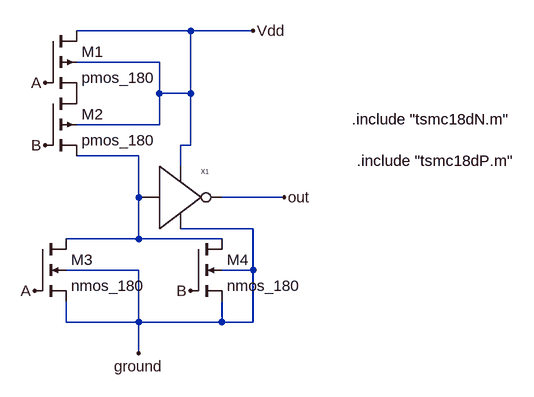
[diagram p0: schematic CMOS_OR.asc]
CMOS_OR.asc, the LTspice schematic file:
Version 4.1
SHEET 1 1396 704
WIRE 448 80 272 80
WIRE 544 80 448 80
WIRE 400 128 272 128
WIRE 400 176 400 128
WIRE 448 176 448 80
WIRE 448 176 400 176
WIRE 400 224 400 176
WIRE 400 224 272 224
WIRE 448 256 448 176
WIRE 448 256 432 256
WIRE 368 272 272 272
WIRE 432 288 432 256
WIRE 368 336 368 272
WIRE 592 336 496 336
WIRE 544 384 432 384
WIRE 368 400 368 336
WIRE 368 400 256 400
WIRE 496 400 368 400
WIRE 368 448 256 448
WIRE 544 448 544 384
WIRE 544 448 496 448
WIRE 256 528 256 496
WIRE 368 528 368 448
WIRE 368 528 256 528
WIRE 496 528 496 496
WIRE 496 528 368 528
WIRE 544 528 544 448
WIRE 544 528 496 528
WIRE 368 576 368 528
FLAG 224 160 A
FLAG 208 480 A
FLAG 448 480 B
FLAG 224 256 B
FLAG 592 336 out
FLAG 544 80 Vdd
FLAG 368 576 ground
SYMBOL pmos4 224 80 R0
SYMATTR InstName M1
SYMATTR Value pmos_180
SYMATTR Value2 l=180n w=1u
SYMBOL pmos4 224 176 R0
SYMATTR InstName M2
SYMATTR Value pmos_180
SYMATTR Value2 l=180n w=1u
SYMBOL nmos4 208 400 R0
SYMATTR InstName M3
SYMATTR Value nmos_180
SYMATTR Value2 l=180n w=1u
SYMBOL nmos4 448 400 R0
SYMATTR InstName M4
SYMATTR Value nmos_180
SYMATTR Value2 l=180n w=1u
SYMBOL CMOS_NOT 416 336 R0
SYMATTR InstName X1
TEXT 696 216 Left 2 !.include "tsmc18dN.m"
TEXT 704 280 Left 2 !.include "tsmc18dP.m"

The netlist it stands for:
* CMOS_OR.asc
M1 Vdd A P001 Vdd pmos_180 l=180n w=1u
M2 P001 B N001 Vdd pmos_180 l=180n w=1u
M3 N001 A ground ground nmos_180 l=180n w=1u
M4 N001 B ground ground nmos_180 l=180n w=1u
X§X1 Vdd ground N001 out CMOS_NOT  ; pins Vdd ground in out
.model NMOS NMOS
.model PMOS PMOS
.lib standard.mos
.include "tsmc18dN.m"
.include "tsmc18dP.m"
.backanno
.end